# Altium schematic sheet HF_Control.SchDoc
size 420 x 297 mm; Date: 28.01.2023; ApprovedBy: UA3REO; CheckedBy: UA3REO; Author: RU4PN; CompanyName: Wolf Team; DocumentNumber: Wolf2 - HF Amp - Control; SheetNumber: 1; SheetTotal: 3
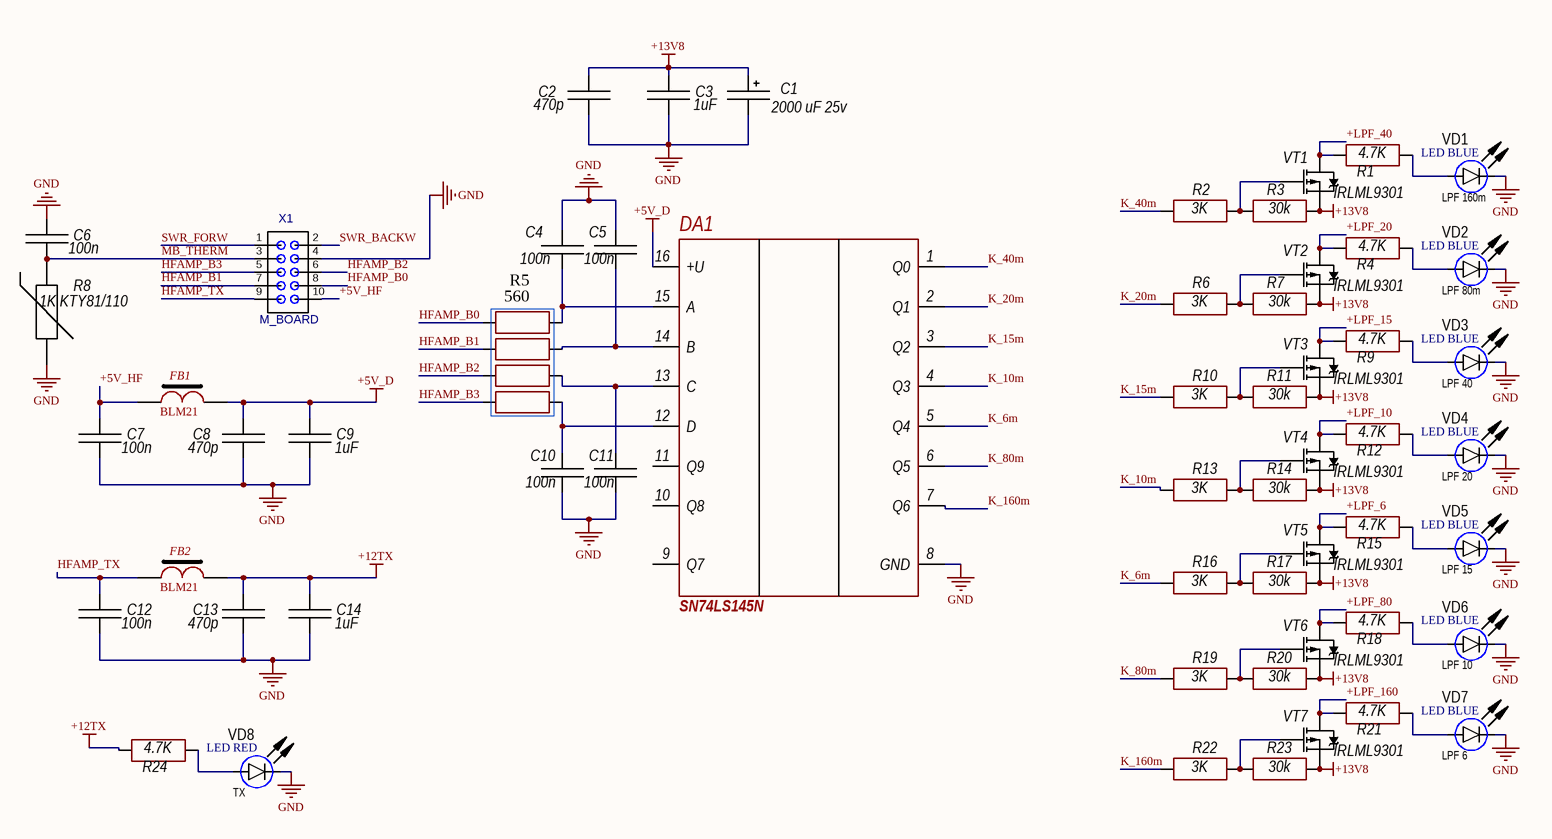
[diagram p0: HF_Control.SchDoc]

## Parts
C1  2000 uF 25v  [D13C5H20]
C2  470p  [CH0805C]
C3  1uF  [CH0805C]
C4  100n  [CH0805C]
C5  100n  [CH0805C]
C6  100n  [CH0805C]
C7  100n  [CH0805C]
C8  470p  [CH0805C]
C9  1uF  [CH0805C]
C10  100n  [CH0805C]
C11  100n  [CH0805C]
C12  100n  [CH0805C]
C13  470p  [CH0805C]
C14  1uF  [CH0805C]
DA1  SN74LS145N  [16-SOP]
FB1  BLM21  [CH0805L]
FB2  BLM21  [CH0805L]
R1  4.7K  [CH0805R]
R2  3K  [CH0805R]
R3  30k  [CH0805R]
R4  4.7K  [CH0805R]
R5  560  [CAT16]
R6  3K  [CH0805R]
R7  30k  [CH0805R]
R8  1K KTY81/110  [CON: PBS-2]
R9  4.7K  [CH0805R]
R10  3K  [CH0805R]
R11  30k  [CH0805R]
R12  4.7K  [CH0805R]
R13  3K  [CH0805R]
R14  30k  [CH0805R]
R15  4.7K  [CH0805R]
R16  3K  [CH0805R]
R17  30k  [CH0805R]
R18  4.7K  [CH0805R]
R19  3K  [CH0805R]
R20  30k  [CH0805R]
R21  4.7K  [CH0805R]
R22  3K  [CH0805R]
R23  30k  [CH0805R]
R24  4.7K  [CH0805R]
VD1  LED BLUE  Color: LPF 160m  [LED: 0805B]
VD2  LED BLUE  Color: LPF 80m  [LED: 0805B]
VD3  LED BLUE  Color: LPF 40  [LED: 0805B]
VD4  LED BLUE  Color: LPF 20  [LED: 0805B]
VD5  LED BLUE  Color: LPF 15  [LED: 0805B]
VD6  LED BLUE  Color: LPF 10  [LED: 0805B]
VD7  LED BLUE  Color: LPF 6  [LED: 0805B]
VD8  LED RED  Color: TX  [LED: 0805R]
VT1  IRLML9301  [SOT23_132]
VT2  IRLML9301  [SOT23_132]
VT3  IRLML9301  [SOT23_132]
VT4  IRLML9301  [SOT23_132]
VT5  IRLML9301  [SOT23_132]
VT6  IRLML9301  [SOT23_132]
VT7  IRLML9301  [SOT23_132]
X1  M_BOARD  [CON: BH-10]

## Nets
+5V_D: C8.1 C9.1 DA1.16(+U) FB1.1
+12TX: C13.1 C14.1 FB2.1 R24.2
+13V8: C1.1 C2.1 C3.1 R3.1 R7.1 R11.1 R14.1 R17.1 R20.1 R23.1 VT1.2(S) VT2.2(S) VT3.2(S) VT4.2(S) VT5.2(S) VT6.2(S) VT7.2(S)
GND: C1.2 C2.2 C3.2 C4.1 C5.1 C6.1 C7.2 C8.2 C9.2 C10.2 C11.2 C12.2 C13.2 C14.2 DA1.8(GND) R8.1 VD1.2(C) VD2.2(C) VD3.2(C) VD4.2(C) VD5.2(C) VD6.2(C) VD7.2(C) VD8.2(C) X1.4
+5V_HF: C7.1 FB1.2 X1.10
+LPF_6: R15.2 VT5.3(D)
+LPF_10: R12.2 VT4.3(D)
+LPF_15: R9.2 VT3.3(D)
+LPF_20: R4.2 VT2.3(D)
+LPF_40: R1.2 VT1.3(D)
+LPF_80: R18.2 VT6.3(D)
+LPF_160: R21.2 VT7.3(D)
HFAMP_B0: R5.1 X1.8
HFAMP_B1: R5.2 X1.7
HFAMP_B2: R5.3 X1.6
HFAMP_B3: R5.4 X1.5
HFAMP_TX: C12.1 FB2.2 X1.9
K_6m: DA1.5(Q4) R16.2
K_10m: DA1.4(Q3) R13.2
K_15m: DA1.3(Q2) R10.2
K_20m: DA1.2(Q1) R6.2
K_40m: DA1.1(Q0) R2.2
K_80m: DA1.6(Q5) R19.2
K_160m: DA1.7(Q6) R22.2
MB_THERM: C6.2 R8.2 X1.3
SWR_BACKW: X1.2
SWR_FORW: X1.1
NetC4_2: C4.2 DA1.15(A) R5.5
NetC5_2: C5.2 DA1.14(B) R5.6
NetC10_1: C10.1 DA1.12(D) R5.8
NetC11_1: C11.1 DA1.13(C) R5.7
NetR1_1: R1.1 VD1.1(A)
NetR2_1: R2.1 R3.2 VT1.1(G)
NetR4_1: R4.1 VD2.1(A)
NetR6_1: R6.1 R7.2 VT2.1(G)
NetR9_1: R9.1 VD3.1(A)
NetR10_1: R10.1 R11.2 VT3.1(G)
NetR12_1: R12.1 VD4.1(A)
NetR13_1: R13.1 R14.2 VT4.1(G)
NetR15_1: R15.1 VD5.1(A)
NetR16_1: R16.1 R17.2 VT5.1(G)
NetR18_1: R18.1 VD6.1(A)
NetR19_1: R19.1 R20.2 VT6.1(G)
NetR21_1: R21.1 VD7.1(A)
NetR22_1: R22.1 R23.2 VT7.1(G)
NetR24_1: R24.1 VD8.1(A)

Not connected (* = marked no-connect by the designer): DA1 9(Q7) 10(Q8) 11(Q9)

## Notes on the sheet
- Подп. и дата
- Инв. № дубл.
- Взам. инв. №
- Инв. № подл.
- Изм.
- Лист
- № докум.
- Подп.
- Дата
- 2.106-A3
- Копировал
- Формат А3

## Library data of the parts
C1 = AlumCap: Manufacturer: *; Model: *; HelpURL: *; ComponentKind: *; Value: *
C2-C14 = Capacitor: Manufacturer: *; Model: *; HelpURL: *; ComponentKind: *; Value: *
FB1 FB2 = FB-1
R1-R4 R6 R7 R9-R24 = Resistor: Manufacturer: *; Model: *; HelpURL: *; ComponentKind: *; Value: *
R5 = CAT10-0804
R8 = NTC: Manufacturer: *; Model: *; HelpURL: *; ComponentKind: *; Value: *
VD1-VD8 = LED_single: ValueManufacturerPartNumber: LED, *, *, *, -55...+150°C; Manufacturer: *; Package: *; HelpURL: *; Temperature: -55...+150°C; TypeDiode: LED; Current: *; VoltageDrop: *; PartNumber: *
VT1-VT7 = IRLML9301: Mosfet; Model: *; Manufacturer: *; ComponentKind: *; HelpURL: *
X1 = IDC10: 2*5 Pin